# Altium schematic sheet Sheet1.SchDoc
size A
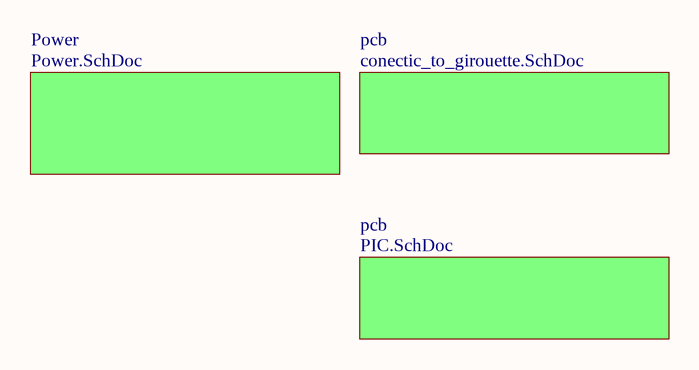
[diagram p0: Sheet1.SchDoc]

## Sub-sheets
pcb = conectic_to_girouette.SchDoc: no entries
pcb = PIC.SchDoc: no entries
Power = Power.SchDoc: no entries